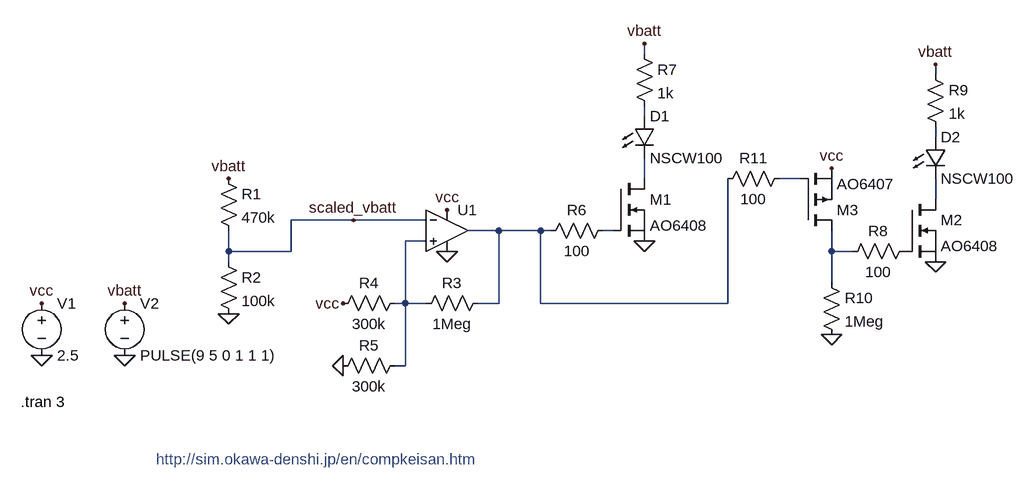
[diagram p0: schematic BatteryMonitor.asc]
BatteryMonitor.asc, the LTspice schematic file:
Version 4
SHEET 1 1228 680
WIRE 656 -160 656 -176
WIRE 1104 -128 1104 -144
WIRE 656 -64 656 -80
WIRE 1104 -32 1104 -48
WIRE 656 32 656 0
WIRE 896 32 864 32
WIRE 1104 64 1104 32
WIRE 208 96 112 96
WIRE 320 96 208 96
WIRE 432 112 384 112
WIRE 496 112 432 112
WIRE 512 112 496 112
WIRE 608 112 592 112
WIRE 320 128 288 128
WIRE 16 144 16 112
WIRE 112 144 112 96
WIRE 112 144 16 144
WIRE 944 144 944 112
WIRE 976 144 944 144
WIRE 16 160 16 144
WIRE 944 192 944 144
WIRE 288 224 288 128
WIRE 288 224 272 224
WIRE 320 224 288 224
WIRE 432 224 432 112
WIRE 432 224 400 224
WIRE 496 224 496 112
WIRE 784 224 784 32
WIRE 784 224 496 224
WIRE 288 320 288 224
WIRE 288 320 272 320
FLAG -272 304 0
FLAG -144 304 0
FLAG -272 224 vcc
FLAG 352 80 vcc
FLAG 352 144 0
FLAG -144 224 vbatt
FLAG 16 240 0
FLAG 16 32 vbatt
FLAG 208 96 scaled_vbatt
FLAG 192 320 0
FLAG 192 224 vcc
FLAG 656 128 0
FLAG 656 -176 vbatt
FLAG 1104 160 0
FLAG 1104 -144 vbatt
FLAG 944 272 0
FLAG 944 16 vcc
SYMBOL OpAmps\\UniversalOpAmp2 352 112 R0
SYMATTR InstName U1
SYMATTR SpiceLine2 En=0 Enk=0 In=200p Ink=400p Rin=500Meg
SYMBOL voltage -272 208 R0
WINDOW 123 0 0 Left 0
WINDOW 39 0 0 Left 0
SYMATTR InstName V1
SYMATTR Value 2.5
SYMBOL voltage -144 208 R0
WINDOW 123 0 0 Left 0
WINDOW 39 0 0 Left 0
SYMATTR InstName V2
SYMATTR Value PULSE(9 5 0 1 1 1)
SYMBOL res 0 16 R0
SYMATTR InstName R1
SYMATTR Value 470k
SYMBOL res 0 144 R0
SYMATTR InstName R2
SYMATTR Value 100k
SYMBOL res 416 208 R90
WINDOW 0 0 56 VBottom 2
WINDOW 3 32 56 VTop 2
SYMATTR InstName R3
SYMATTR Value 1Meg
SYMBOL res 288 208 R90
WINDOW 0 0 56 VBottom 2
WINDOW 3 32 56 VTop 2
SYMATTR InstName R4
SYMATTR Value 300k
SYMBOL res 288 304 R90
WINDOW 0 0 56 VBottom 2
WINDOW 3 32 56 VTop 2
SYMATTR InstName R5
SYMATTR Value 300k
SYMBOL res 608 96 R90
WINDOW 0 0 56 VBottom 2
WINDOW 3 32 56 VTop 2
SYMATTR InstName R6
SYMATTR Value 100
SYMBOL res 640 -176 R0
SYMATTR InstName R7
SYMATTR Value 1k
SYMBOL LED 640 -64 R0
SYMATTR InstName D1
SYMATTR Value NSCW100
SYMATTR Description Diode
SYMATTR Type diode
SYMBOL res 1072 128 R90
WINDOW 0 0 56 VBottom 2
WINDOW 3 32 56 VTop 2
SYMATTR InstName R8
SYMATTR Value 100
SYMBOL res 1088 -144 R0
SYMATTR InstName R9
SYMATTR Value 1k
SYMBOL LED 1088 -32 R0
SYMATTR InstName D2
SYMATTR Value NSCW100
SYMATTR Description Diode
SYMATTR Type diode
SYMBOL res 928 176 R0
SYMATTR InstName R10
SYMATTR Value 1Meg
SYMBOL res 880 16 R90
WINDOW 0 0 56 VBottom 2
WINDOW 3 32 56 VTop 2
SYMATTR InstName R11
SYMATTR Value 100
SYMBOL nmos 1056 64 R0
SYMATTR InstName M2
SYMATTR Value AO6408
SYMBOL nmos 608 32 R0
SYMATTR InstName M1
SYMATTR Value AO6408
SYMBOL pmos 896 112 M180
SYMATTR InstName M3
SYMATTR Value AO6407
TEXT -304 376 Left 2 !.tran 3
TEXT -96 464 Left 2 ;http://sim.okawa-denshi.jp/en/compkeisan.htm

The netlist it stands for:
* BatteryMonitor.asc
XU1 N008 scaled_vbatt vcc 0 N006 level2 Avol=1Meg GBW=10Meg Slew=10Meg Ilimit=25m Rail=0 Vos=0 En=0 Enk=0 In=200p Ink=400p Rin=500Meg  ; pins In+ In- V+ V- OUT
V1 vcc 0 2.5
V2 vbatt 0 PULSE(9 5 0 1 1 1)
R1 vbatt scaled_vbatt 470k
R2 scaled_vbatt 0 100k
R3 N006 N008 1Meg
R4 N008 vcc 300k
R5 N008 0 300k
R6 N007 N006 100
R7 vbatt N001 1k
D1 N001 N003 NSCW100
R8 P001 N009 100
R9 vbatt N002 1k
D2 N002 N005 NSCW100
R10 N009 0 1Meg
R11 N004 N006 100
M2 N005 P001 0 0 AO6408
M1 N003 N007 0 0 AO6408
M3 N009 N004 vcc vcc AO6407
.model D D
.lib standard.dio
.model NMOS NMOS
.model PMOS PMOS
.lib standard.mos
.tran 3
* http://sim.okawa-denshi.jp/en/compkeisan.htm
.lib UniversalOpAmp2.lib
.backanno
.end